# Altium schematic sheet XT30PW-M_2023-02-07.schdoc
size 41 x 35 mm
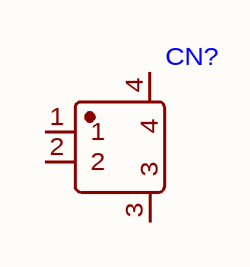
[diagram p0: XT30PW-M_2023-02-07.schdoc]

## Parts
CN?  (no value)  [CONN-TH_XT30PW-M]

## Nets

Not connected (* = marked no-connect by the designer): CN? 1 2 3 4

## Library data of the parts
CN? = XT30PW-M